# Altium schematic sheet 2-port SPI-UART bridge.SchDoc
size A4
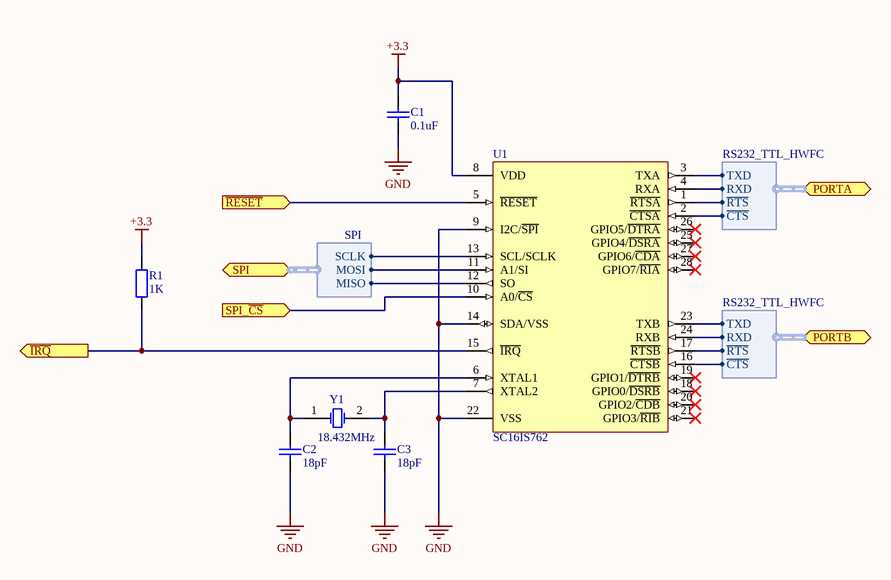
[diagram p0: 2-port SPI-UART bridge.SchDoc]

## Parts
C1  value 0.1uF  [C0603]  (hidden comment: Cap)
C2  value 18pF  [C0603]  (hidden comment: Cap)
C3  value 18pF  [C0603]  (hidden comment: Cap)
R1  value 1K  [R0603]  (hidden comment: Res)
U1  SC16IS762  [SC16IS762IPW]
Y1  value 18.432MHz  [7A-18.432MAAJ-T]  (hidden comment: XTAL)

## Ports
PORTA (harness RS232_TTL_HWFC), PORTB (harness RS232_TTL_HWFC), SPI (harness SPI), SPI_~{CS} (in), ~{IRQ} (out), ~{RESET} (in)

## Harnesses
RS232_TTL_HWFC: TXD, RXD, ~{RTS}, ~{CTS}
SPI: SCLK, MOSI, MISO

## Nets
+3.3: C1.1 R1.2 U1.8(VDD)
GND: C1.2 C2.2 C3.2 U1.9(I2C/~{SPI}) U1.14(SDA/VSS) U1.22(VSS)
~{IRQ}: R1.1 U1.15(~{IRQ}) ; port ~{IRQ}
~{RESET}: U1.5(~{RESET}) ; port ~{RESET}
SPI_~{CS}: U1.10(A0/~{CS}) ; port SPI_~{CS}
NetC2_1: C2.1 U1.6(XTAL1) Y1.1(OSC1)
NetC3_1: C3.1 U1.7(XTAL2) Y1.2(OSC2)
NetU1_1: U1.1(~{RTSA}) ; port PORTA.~{RTS}
NetU1_2: U1.2(~{CTSA}) ; port PORTA.~{CTS}
NetU1_3: U1.3(TXA) ; port PORTA.TXD
NetU1_4: U1.4(RXA) ; port PORTA.RXD
NetU1_11: U1.11(A1/SI) ; port SPI.MOSI
NetU1_12: U1.12(SO) ; port SPI.MISO
NetU1_13: U1.13(SCL/SCLK) ; port SPI.SCLK
NetU1_16: U1.16(~{CTSB}) ; port PORTB.~{CTS}
NetU1_17: U1.17(~{RTSB}) ; port PORTB.~{RTS}
NetU1_23: U1.23(TXB) ; port PORTB.TXD
NetU1_24: U1.24(RXB) ; port PORTB.RXD

Not connected (* = marked no-connect by the designer): U1 18(GPIO0/~{DSRB})* 19(GPIO1/~{DTRB})* 20(GPIO2/~{CDB})* 21(GPIO3/~{RIB})* 25(GPIO4/~{DSRA})* 26(GPIO5/~{DTRA})* 27(GPIO6/~{CDA})* 28(GPIO7/~{RIA})*

## Library data of the parts
C1-C3 = Cap: Capacitor
  C1: farnell: 1759122
  C2 C3: farnell: 1759056
R1 = Res2: Resistor; farnell: 9330380
U1 = SC16IS762: NXP - SC16IS762IPW,112 - IC, DUAL UART, FIFO, 5MBPS 3.6V, TSSOP28; digikey: 568-4021-5-ND
Y1 = XTAL: Crystal Oscillator; Published: 8-Jun-2000; LatestRevisionDate: 17-Jul-2002; LatestRevisionNote: Re-released for DXP Platform.; PackageReference: R38; Publisher: Altium Limited; farnell: 1841949